# Altium schematic sheet 8.PCIE-WIFI.SchDoc: MC-IMX6UL-CORE
size A4; DrawnBy: DrawnBy; DocumentNumber: MC-IMX6UL-CORE; Revision: V1.1; SheetNumber: 8 of 9
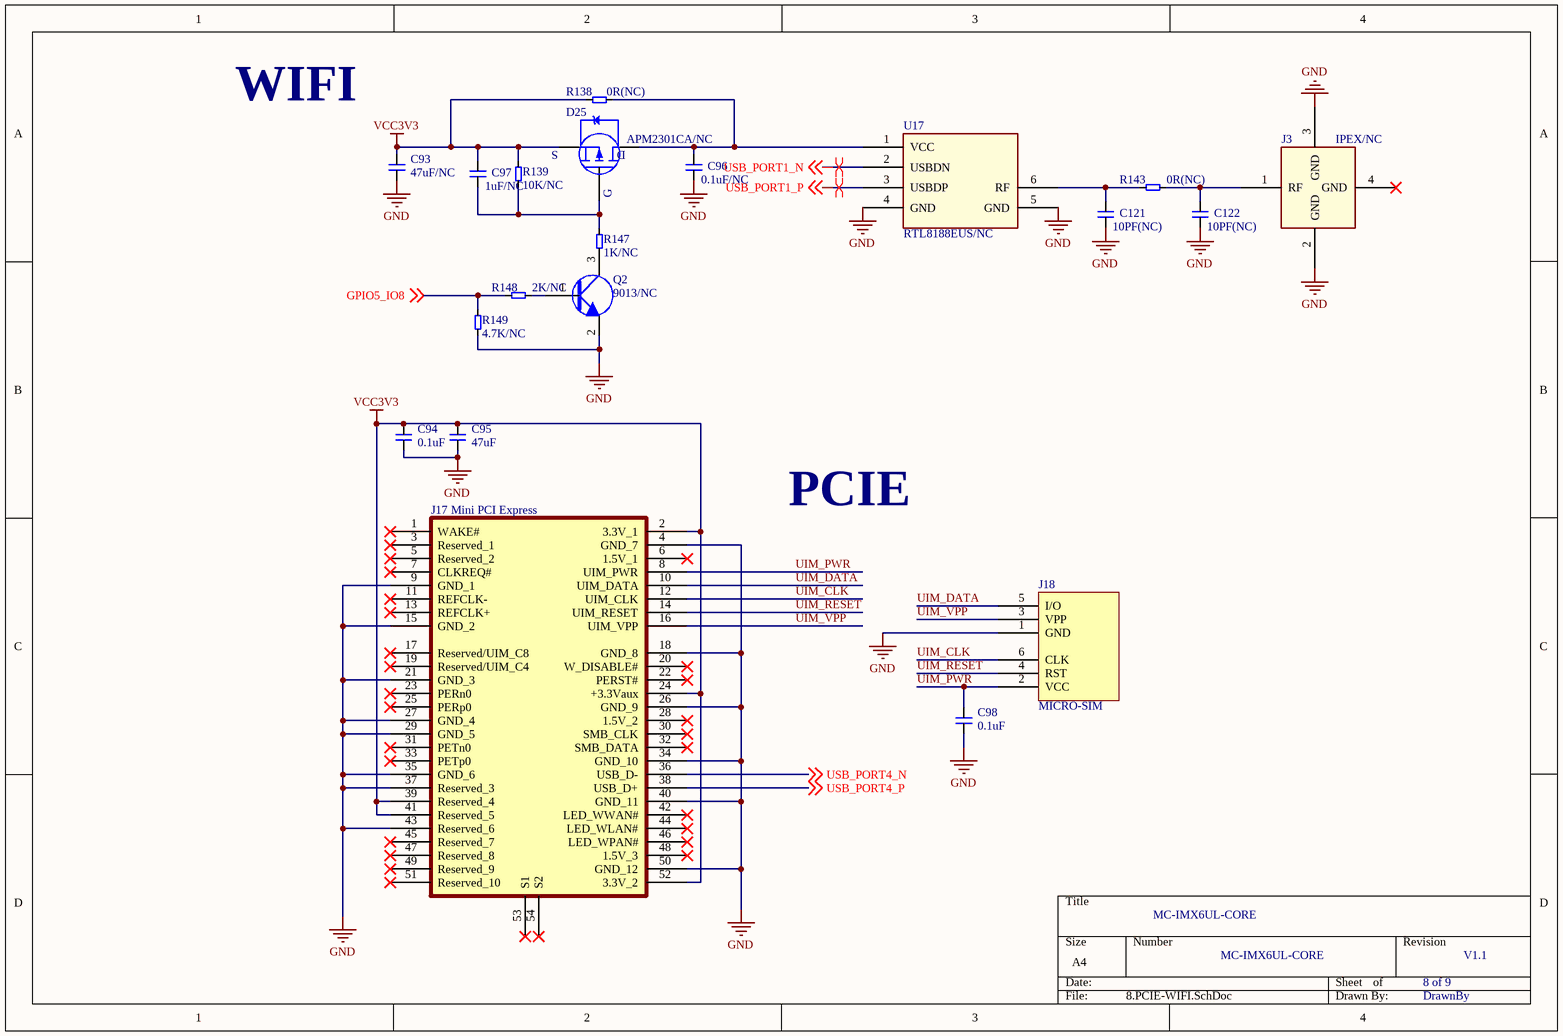
[diagram p0: 8.PCIE-WIFI.SchDoc]

## Parts
C93  47uF/NC  [1206C]
C94  0.1uF  [0603C]
C95  47uF  [1206C]
C96  0.1uF/NC  [0603C]
C97  1uF/NC  [0603C]
C98  0.1uF  [0603C]
C121  10PF(NC)  [0402C]
C122  10PF(NC)  [0402C]
D25  APM2301CA/NC  [SOT-23]
J3  IPEX/NC  [IPEX]
J17  Mini PCI Express  [MINI-PCIE]
J18  MICRO-SIM  [MACRO-SIM]
Q2  9013/NC  [SOT-23]
R138  0R(NC)  [0603R]
R139  10K/NC  [0603R]
R143  0R(NC)  [0402R]
R147  1K/NC  [0603R]
R148  2K/NC  [0603R]
R149  4.7K/NC  [0603R]
U17  RTL8188EUS/NC  [RTL8188EUS 13*12.2]

## Nets
GND: C93.2 C94.2 C95.2 C96.2 C98.2 C121.2 C122.2 J3.2(GND) J3.3(GND) J17.4(GND_7) J17.9(GND_1) J17.15(GND_2) J17.18(GND_8) J17.21(GND_3) J17.26(GND_9) J17.27(GND_4) J17.29(GND_5) J17.34(GND_10) J17.35(GND_6) J17.37(Reserved_3) J17.40(GND_11) J17.43(Reserved_6) J17.50(GND_12) J18.1(GND) Q2.2 R149.2 U17.4(GND) U17.5(GND)
VCC3V3: C93.1 C94.1 C95.1 C97.1 D25.2 J17.2(3.3V_1) J17.24(+3.3Vaux) J17.39(Reserved_4) J17.41(Reserved_5) J17.52(3.3V_2) R138.2 R139.2
GPIO5_IO8: R148.1 R149.1 ; off-sheet GPIO5_IO8
UIM_CLK: J17.12(UIM_CLK) J18.6(CLK)
UIM_DATA: J17.10(UIM_DATA) J18.5(I/O)
UIM_PWR: C98.1 J17.8(UIM_PWR) J18.2(VCC)
UIM_RESET: J17.14(UIM_RESET) J18.4(RST)
UIM_VPP: J17.16(UIM_VPP) J18.3(VPP)
USB_PORT1_N: U17.2(USBDN) ; off-sheet USB_PORT1_N
USB_PORT1_P: U17.3(USBDP) ; off-sheet USB_PORT1_P
USB_PORT4_N: J17.36(USB_D-) ; off-sheet USB_PORT4_N
USB_PORT4_P: J17.38(USB_D+) ; off-sheet USB_PORT4_P
NetC96_1: C96.1 D25.3 R138.1 U17.1(VCC)
NetC97_2: C97.2 D25.1 R139.1 R147.2
NetC121_1: C121.1 R143.1 U17.6(RF)
NetC122_1: C122.1 J3.1(RF) R143.2
NetQ2_1: Q2.1 R148.2
NetQ2_3: Q2.3 R147.1

Not connected (* = marked no-connect by the designer): J3 4(GND)*; J17 1(WAKE#)* 3(Reserved_1)* 5(Reserved_2)* 6(1.5V_1)* 7(CLKREQ#)* 11(REFCLK-)* 13(REFCLK+)* 17(Reserved/UIM_C8)* 19(Reserved/UIM_C4)* 20(W_DISABLE#)* 22(PERST#)* 23(PERn0)* 25(PERp0)* 28(1.5V_2)* 30(SMB_CLK)* 31(PETn0)* 32(SMB_DATA)* 33(PETp0)* 42(LED_WWAN#)* 44(LED_WLAN#)* 45(Reserved_7)* 46(LED_WPAN#)* 47(Reserved_8)* 48(1.5V_3)* 49(Reserved_9)* 51(Reserved_10)* 53(S1)* 54(S2)*

## Layout directives
differential pair: USB_PORT1_N, USB_PORT1_P

## Notes on the sheet
- WIFI
- PCIE
- (in symbol APM2301CA) S; D; G

## Library data of the parts
C93-C98 C121 C122 = 电容
D25 = APM2301CA
J3 = IPEX
J17 = MINIPCIE: MPC24-52K3311
Q2 = 9013
R138 R139 R143 R147-R149 = 电阻
U17 = RTL8188EUS-13*12.2